# Altium schematic sheet do_an.SchDoc
size A; SheetNumber: 1; SheetTotal: 1
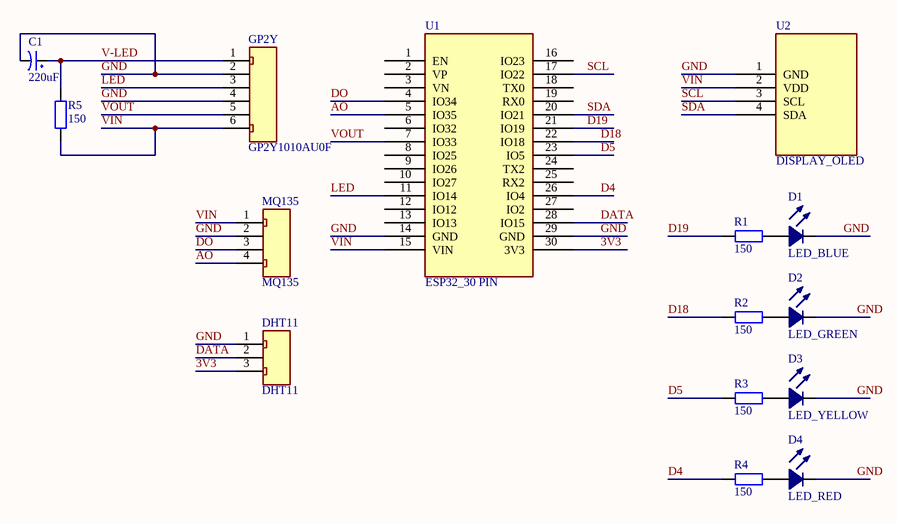
[diagram p0: do_an.SchDoc]

## Parts
C1  220uF  [CP1.5/3.4]
D1  LED_BLUE  [LED_5mm_BLUE]
D2  LED_GREEN  [LED_5mm_GREEN]
D3  LED_YELLOW  [LED_5mm_YELLOW]
D4  LED_RED  [LED_5mm_RED]
DHT11  DHT11  [JST-2.54-3P]
GP2Y  GP2Y1010AU0F  [JST-2.54-6P]
MQ135  MQ135  [JST-2.54-4P]
R1  150  [R1/4W]
R2  150  [R1/4W]
R3  150  [R1/4W]
R4  150  [R1/4W]
R5  150  [R1/4W]
U1  ESP32_30 PIN  [ESP32_30]
U2  DISPLAY_OLED  [DISPLAY_OLED]

## Nets
3V3: DHT11.3 U1.30(3V3)
AO: MQ135.4 U1.5(IO35)
D4: R4.1 U1.26(IO4)
D5: R3.1 U1.23(IO5)
D18: R2.1 U1.22(IO18)
D19: R1.1 U1.21(IO19)
DATA: DHT11.2 U1.28(IO15)
DO: MQ135.3 U1.4(IO34)
GND: C1.2 D1.2 D2.2 D3.2 D4.2 DHT11.1 GP2Y.2 GP2Y.4 MQ135.2 U1.14(GND) U1.29(GND) U2.1(GND)
LED: GP2Y.3 U1.11(IO14)
SCL: U1.17(IO22) U2.3(SCL)
SDA: U1.20(IO21) U2.4(SDA)
V-LED: C1.1 GP2Y.1 R5.2
VIN: GP2Y.6 MQ135.1 R5.1 U1.15(VIN) U2.2(VDD)
VOUT: GP2Y.5 U1.7(IO33)
NetD1_1: D1.1 R1.2
NetD2_1: D2.1 R2.2
NetD3_1: D3.1 R3.2
NetD4_1: D4.1 R4.2

Not connected (* = marked no-connect by the designer): U1 1(EN) 2(VP) 3(VN) 6(IO32) 8(IO25) 9(IO26) 10(IO27) 12(IO12) 13(IO13) 16(IO23) 18(TX0) 19(RX0) 24(TX2) 25(RX2) 27(IO2)

## Library data of the parts
C1 = CP4: Cap 1000uF/16V - 220uF/50V; Description 5: 4,7uF>10uF/250V_3,3uF>10uF/400V - 2,2uF>4,7uF/450V; Description 1: 2200uF-3300uF/6,3V - 1000uF-2200uF/10V; Description 2: 1000uF/16V - 470uF => 1000uF/25V - 100uF/100V; Description 3: 330uF>470uF/35V_220uF>470uF/50V_10uF>22uF/250V; Description 4: 220uF => 330uF/63V - 10uF =>33uF/160 - 200V; Value: 1000uF/16V
D1 = LED_5mm_BLUE: LED PTH 5mm Blue.
D2 = LED_5mm_GREEN: LED PTH 5mm Green.
D3 = LED_5mm_YELLOW: LED PTH 5mm Yellow.
D4 = LED_5mm_RED: LED PTH 5mm Red.
DHT11 = JST-2.54-3P: Female Connector JST 3 Vias, 2.54mm.
GP2Y = JST-2.54-6P: Female Connector JST 6 Vias, 2.54mm.
MQ135 = JST-2.54-4P: Female Connector JST 4 Vias, 2.54mm.
R1-R5 = R1/4W: Resistor 1/4W; Value: R1/4W - 1K
U1 = ESP32_30: Microcontoller Board 30 Pins Wifi 2.4GHz BLE 4.2 ESP32-WROOM-32D; ComponentLink1Description: Datasheet; ComponentLink1URL: https://www.mouser.com/datasheet/2/891/esp32_wroom_32d_esp32_wroom_32u_datasheet_en-1365844.pdf
U2 = DISPLAY_OLED: Display Oled 128x64 0.96" I2C.